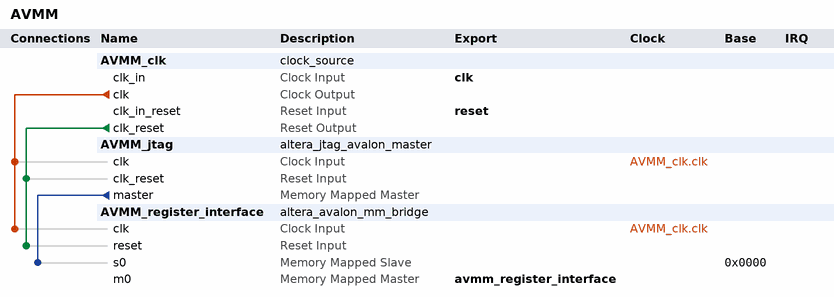
[diagram p0: system contents]
# Platform Designer (Qsys) system AVMM, Arria 10 10AX115S1F45I1SG
# Parameters at their usual value, and those the tool derives, are not listed.
package require -exact qsys 16.0
create_system AVMM
set_project_property DEVICE_FAMILY {Arria 10}
set_project_property DEVICE 10AX115S1F45I1SG

add_instance AVMM_clk clock_source 16.0
set_instance_parameter_value AVMM_clk clockFrequency 50000000

add_instance AVMM_jtag altera_jtag_avalon_master 16.0

add_instance AVMM_register_interface altera_avalon_mm_bridge 16.0
set_instance_parameter_value AVMM_register_interface ADDRESS_UNITS SYMBOLS
set_instance_parameter_value AVMM_register_interface ADDRESS_WIDTH 2
set_instance_parameter_value AVMM_register_interface DATA_WIDTH 8
set_instance_parameter_value AVMM_register_interface MAX_PENDING_RESPONSES 4
set_instance_parameter_value AVMM_register_interface USE_AUTO_ADDRESS_WIDTH 0

# connections
add_connection AVMM_clk.clk AVMM_jtag.clk clock
add_connection AVMM_clk.clk AVMM_register_interface.clk clock
add_connection AVMM_clk.clk_reset AVMM_jtag.clk_reset reset
add_connection AVMM_clk.clk_reset AVMM_register_interface.reset reset
add_connection AVMM_jtag.master AVMM_register_interface.s0 avalon
set_connection_parameter_value AVMM_jtag.master/AVMM_register_interface.s0 baseAddress 0x0000

# exported interfaces
add_interface avmm_register_interface avalon master
set_interface_property avmm_register_interface EXPORT_OF AVMM_register_interface.m0
add_interface clk clock sink
set_interface_property clk EXPORT_OF AVMM_clk.clk_in
add_interface reset reset sink
set_interface_property reset EXPORT_OF AVMM_clk.clk_in_reset

set_interconnect_requirement {$system} qsys_mm.clockCrossingAdapter HANDSHAKE
set_interconnect_requirement {$system} qsys_mm.enableEccProtection FALSE
set_interconnect_requirement {$system} qsys_mm.insertDefaultSlave FALSE
set_interconnect_requirement {$system} qsys_mm.maxAdditionalLatency 1

save_system AVMM.qsys
